# EAGLE design LEscalierD (EAGLE 7.2.0)
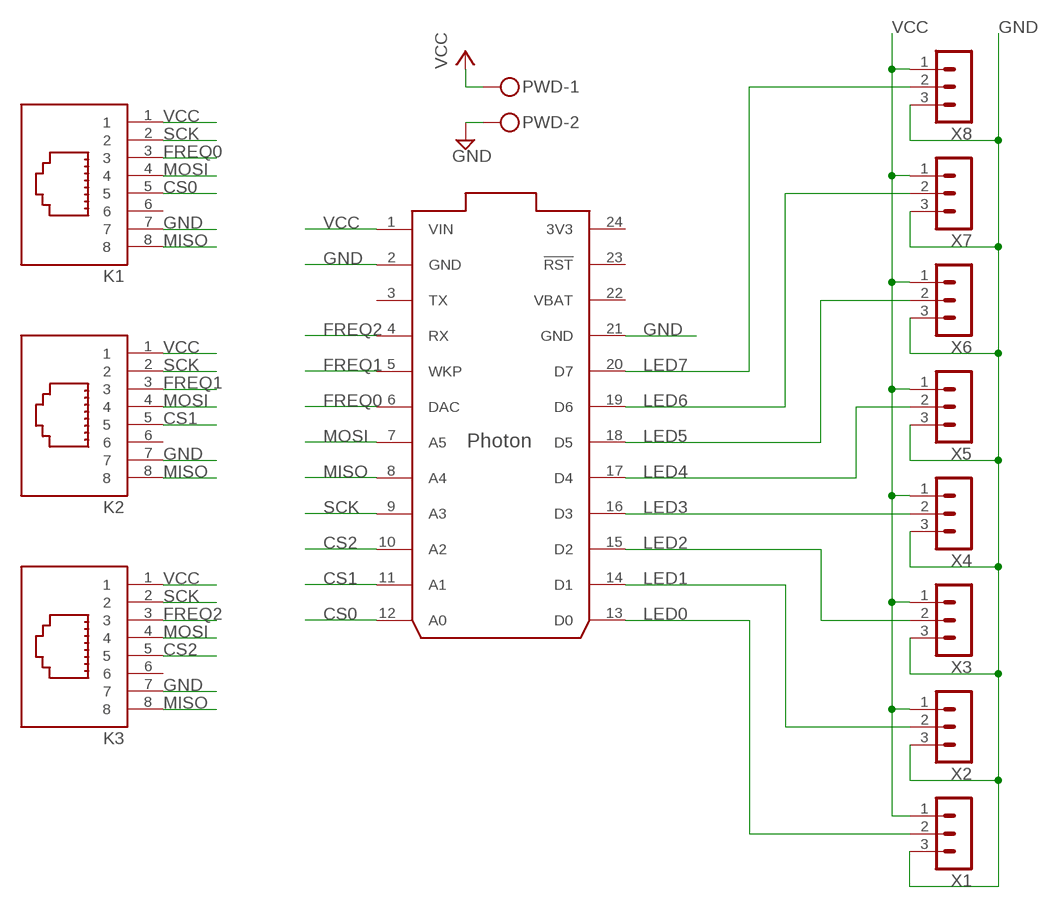
[diagram p0: schematic, sheet 1]

## Parts
K1  615008144221  [615008144221]
K2  615008144221  [615008144221]
K3  615008144221  [615008144221]
PWD  MKDSN1,5/2-5,08  [MKDSN1,5/2-5,08]
U1  PHOTON_WITH_HEADERS  [PHOTON]
X1  B3B-XASTD  [B3B-XA]
X2  B3B-XASTD  [B3B-XA]
X3  B3B-XASTD  [B3B-XA]
X4  B3B-XASTD  [B3B-XA]
X5  B3B-XASTD  [B3B-XA]
X6  B3B-XASTD  [B3B-XA]
X7  B3B-XASTD  [B3B-XA]
X8  B3B-XASTD  [B3B-XA]

## Nets
CS0: K1.5 U1.12(A0)
CS1: K2.5 U1.11(A1)
CS2: K3.5 U1.10(A2)
FREQ0: K1.3 U1.6(DAC)
FREQ1: K2.3 U1.5(WKP)
FREQ2: K3.3 U1.4(RX)
GND [power]: K1.7 K2.7 K3.7 PWD.2 U1.2(GND) U1.21(GND) X1.3 X2.3 X3.3 X4.3 X5.3 X6.3 X7.3 X8.3
LED0 [LED_DATA]: U1.13(D0) X1.2
LED1 [LED_DATA]: U1.14(D1) X2.2
LED2 [LED_DATA]: U1.15(D2) X3.2
LED3 [LED_DATA]: U1.16(D3) X4.2
LED4 [LED_DATA]: U1.17(D4) X5.2
LED5 [LED_DATA]: U1.18(D5) X6.2
LED6 [LED_DATA]: U1.19(D6) X7.2
LED7 [LED_DATA]: U1.20(D7) X8.2
MISO [SPI]: K1.8 K2.8 K3.8 U1.8(A4)
MOSI [SPI]: K1.4 K2.4 K3.4 U1.7(A5)
SCK [SPI]: K1.2 K2.2 K3.2 U1.9(A3)
VCC [power]: K1.1 K2.1 K3.1 PWD.1 U1.1(VIN) X1.1 X2.1 X3.1 X4.1 X5.1 X6.1 X7.1 X8.1
Unconnected: K1.6 K2.6 K3.6 U1.3(TX) U1.23(!RST)

## Power pins joined to a net without a drawn wire
3V3: U1.24(3V3)
VBAT: U1.22(VBAT)

## Library data of the parts
K1-K3 = Input-Output_Connectors_rev15d:615008144221: WR-MJ Vertical Plastic 8P8C Modular Jack With Ears, 8 pins=>Code : Con_I-O_MJ-V_Plastic_615008144221 <http://katalog.we-online.de/media/images/eican/Con_I-O_MJ-V_Plastic_615008144221_pf2.jpg> Details see: http://katalog.we-online.de/en/em/615_008_144_221 Created 2014-07-10, Karrer Zheng 2014 (C) Würth Elektronik
PWD = con-phoenix-508:MKDSN1,5/2-5,08: MKDSN 1,5/ 2-5,08 Printklemme Nennstrom: 13,5 A Nennspannung: 250 V Rastermaß: 5,08 mm Polzahl: 2 Anschlussart: Schraubanschluss Montage: Löten Anschlussrichtung Leiter/Platine: 0 ° Artikelnummer: 1729128 Source: http://eshop.phoenixcontact.com .. 1729128.pdf
U1 = Spark:PHOTON
X1-X8 = con-jst:B3B-XA: JST XA 3POS 2.5MM B03B-XASK-1; MK: DIGIKEY; OC_DIGIKEY: 455-1990-ND; REF: B03B-XASK-1; VEN: JST

## Net classes
0 default: width 0.127 mm
1 power: width 0.508 mm
2 SPI: width 0.178 mm
3 LED_DATA: width 0.229 mm

## Board
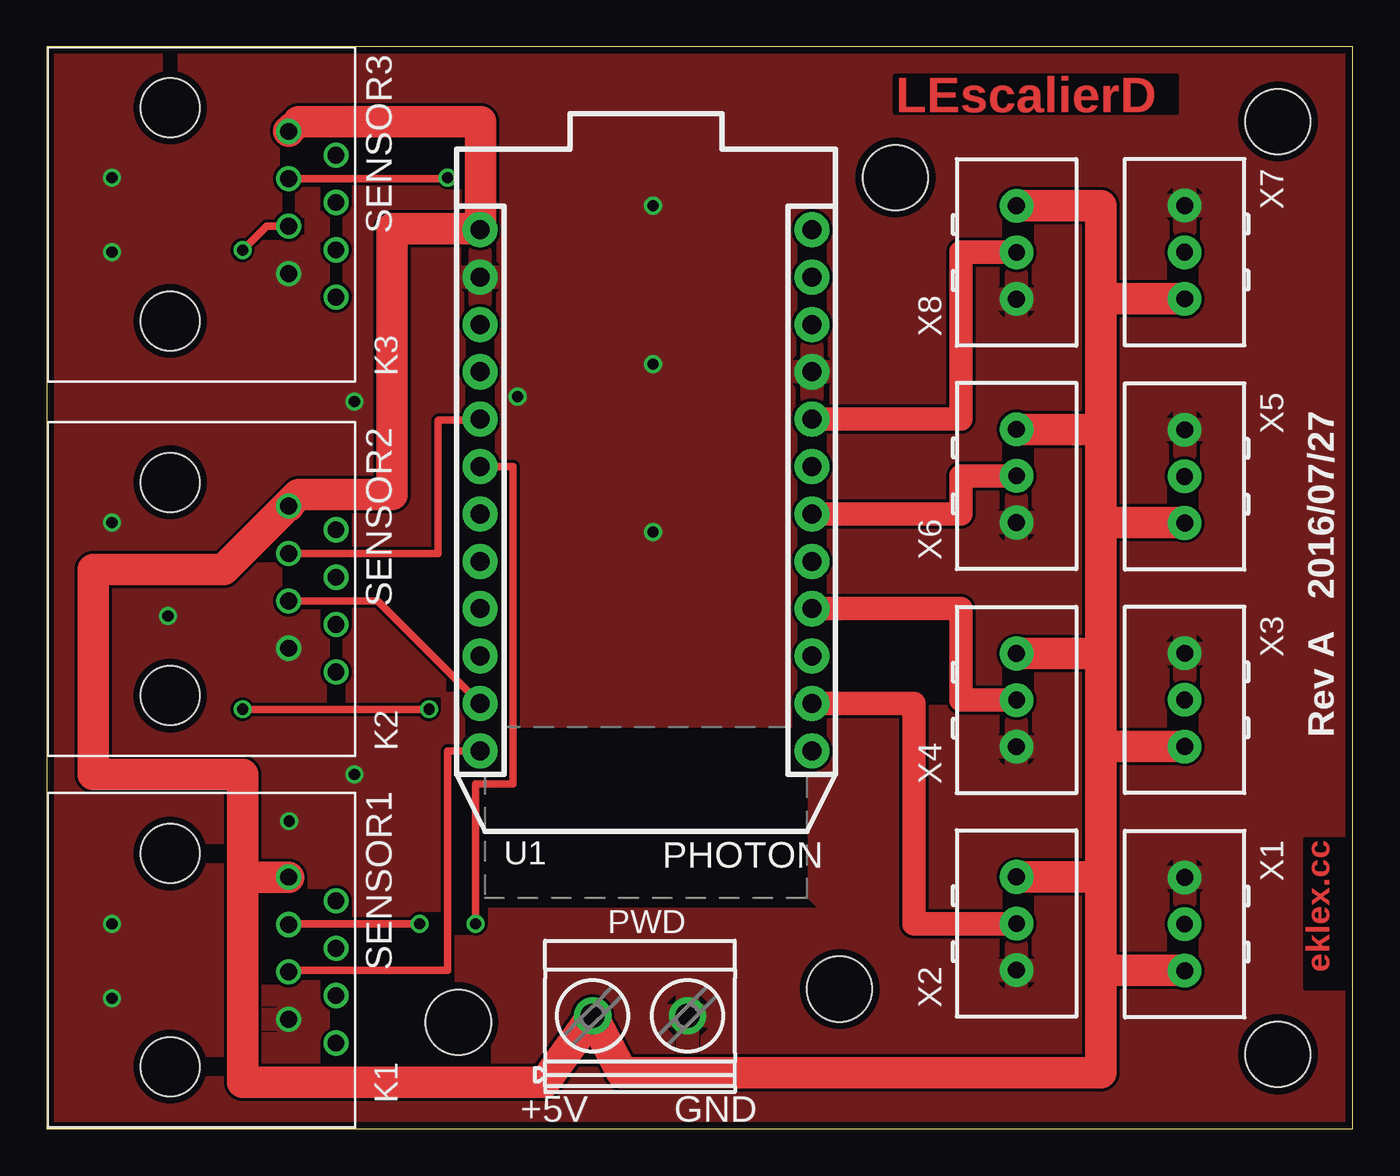
[diagram p1: board, top side]
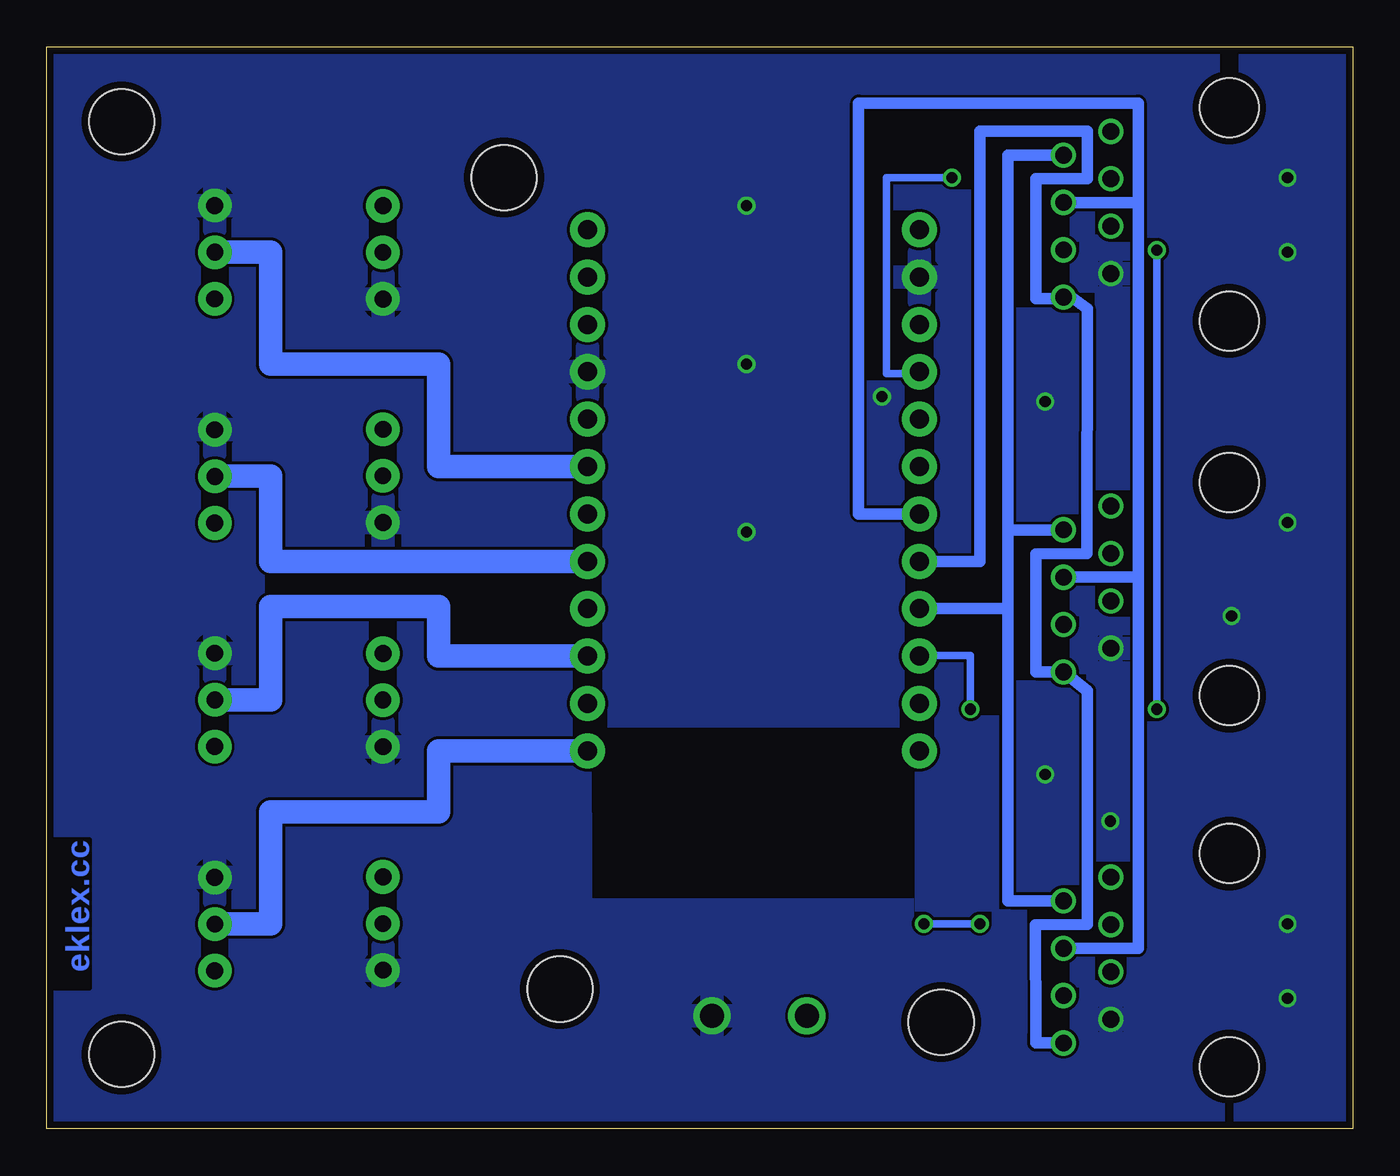
[diagram p2: board, bottom side, seen from below]

Size 70.02 x 58.02 mm. Coordinates in mm from the lower left corner, seen from the top.
Outline: 0,0 70.02,0 70.02,58.02 0,58.02 0,0
Copper layers (1*16): Top 0.0356mm / dielectric 1.5011mm / Bottom 0.0356mm
Design rules "oshpark-2layer": minimum track width 6mil, minimum drill 13mil, track to track 6mil, track to pad 6mil, pad to pad 6mil, via to via 6mil, smd to smd 6mil, copper to edge 15mil, drill to drill 6mil, minimum pad ring 7mil, minimum via ring 7mil, stop-mask expansion 2.5mil, vias tented up to drill 0mil, thermal gap 10mil
Holes 3.5 mm at 45.5,51 42.5,7.5 22.07,5.72 66,54 66,4

### Footprints (pad centres in the part's own frame; a part is rotated, then mirrored left to right if it is on the bottom)
615008144221 = drill 0.9: 1 -4.445,-1.27; 2 -3.175,1.27; 3 -1.905,-1.27; 4 -0.635,1.27; 5 0.635,-1.27; 6 1.905,1.27; 7 3.175,-1.27; 8 4.445,1.27 | hole 3.17: -5.715,-7.62; 5.715,-7.62
MKDSN1,5/2-5,08 = drill 1.3 pad 2: 1 -2.561,0.025; 2 2.519,0.025
PHOTON = drill 1.016 pad 1.88: 1 1.27,32.258; 2 1.27,29.718; 3 1.27,27.178; 4 1.27,24.638; 5 1.27,22.098; 6 1.27,19.558; 7 1.27,17.018; 8 1.27,14.478; 9 1.27,11.938; 10 1.27,9.398; 11 1.27,6.858; 12 1.27,4.318; 13 19.05,4.318; 14 19.05,6.858; 15 19.05,9.398; 16 19.05,11.938; 17 19.05,14.478; 18 19.05,17.018; 19 19.05,19.558; 20 19.05,22.098; 21 19.05,24.638; 22 19.05,27.178; 23 19.05,29.718; 24 19.05,32.258
B3B-XA = drill 0.9 pad 1.8: 1 2.5,0; 2 0,-0.01; 3 -2.5,0

### Placement (x,y rotation side)
K1  14.24,9.05 270 top
K2  14.24,28.94 270 top
K3  14.24,49.03 270 top
PWD  31.83,6.04 0 top
U1  21.97,15.95 0 top
X1  61.01,10.98 270 top
X2  51.99,11.01 90 top
X3  61.01,23 270 top
X4  51.99,22.99 90 top
X5  61.01,34.98 270 top
X6  51.99,35.01 90 top
X7  61.01,47 270 top
X8  51.99,46.99 90 top

### Tracks (layer width: path | path; a pad name or v marks a point on that pad's centre or on a via)
CS0
  Top 0.406: U1.12 21.5,20.27 21.5,8.5 13.05,8.5 K1.5
CS1
  Top 0.406: U1.11 17.74,28.3 K2.5
CS2  (via drill 0.6)
  Top 0.406: v10.5,22.5 v20.5,22.5 | v10.5,47.11 11.79,48.4 K3.5
  Bottom 0.406: U1.10 22.89,25.37 20.5,25.37 v20.5,22.5 | v10.5,47.11 v10.5,22.5
FREQ0  (via drill 0.6)
  Top 0.406: K1.3 13.02,11 v20,11 | v23,11 23,18.5 25,18.5 25,35.5 24.99,35.51 U1.6
  Bottom 0.406: v20,11 v23,11
FREQ1
  Top 0.406: U1.5 23.19,38 21,38 20.98,37.98 20.98,30.84 | 20.98,30.84 | 20.98,30.84 K2.3
FREQ2  (via drill 0.6)
  Top 0.406: v21.5,51 21.43,50.94 K3.3
  Bottom 0.406: U1.4 23.33,40.5 25,40.5 25,51 v21.5,51
GND  (via drill 0.6)
  other vias: 16.5,19 16.5,39 25.24,39.26 13,16.5 3.5,7 3.5,11 3.5,32.5 6.5,27.5 3.5,47 3.5,51 32.5,49.5 32.5,41 32.5,32
  pour Bottom: -5,63 94,63 95,63 95,-4 -5,-4
  pour Top: -6,64 95,64 95,-9 -6,-9 -9,-9 -9,64
LED0
  Bottom 1.27: X1.2 61,11 58,11 58,17 49,17 49,20.27 U1.13
LED1
  Top 1.27: X2.2 46.5,11 46.5,22.81 U1.14
LED2
  Bottom 1.27: X3.2 58,23 58,28 49,28 49,25.35 U1.15
LED3
  Top 1.27: X4.2 49,23 49,27.89 U1.16
LED4
  Bottom 1.27: X5.2 61,35 58,35 58,30.43 U1.17
LED5
  Top 1.27: X6.2 49,35 49,32.97 U1.18
LED6
  Bottom 1.27: X7.2 58,47 58,41 49,41 49,35.51 U1.19
LED7
  Top 1.27: X8.2 49.01,46.99 49,47 49,38.05 U1.20
MISO
  Bottom 0.406: K2.8
  Bottom 0.61: K2.8 17,24.5 16.99,30.83 14.25,30.84 14.24,43.98 15.09,44.59 K3.8 15.51,44.5 17,44.5 17,50.94 14.22,50.94 14.22,53.49 14.32,53.49 14.32,53.5 20,53.5 20,30.43 U1.8 | K2.8 15.49,24.5 14.23,23.48 14.23,10.96 17.01,10.95 17,5 17,4.61 K1.8
MOSI
  Bottom 0.61: K3.4 11.5,49.66 | 11.5,49.66 11.5,29.57 | 11.5,29.57 11.5,9.67 15.51,9.67 K1.4 | K2.4 11.5,29.57 | U1.7 26.5,32.97 26.5,55 11.5,55 11.5,49.66
N$1
  cutout Top: 40.77,12.4 40.78,12.4 40.78,21.5 23.5,21.5 24,11.89 41.27,11.89
N$2
  cutout Bottom: 23.5,21.5 40.78,21.5 40.77,12.39 23.5,12.39
SCK
  Bottom 0.61: 18.5,32.12 18.5,52.19 15.49,52.2 K3.2 | K1.2 18.23,12.22 18.5,12.23 18.5,27.89 | 18.5,32.12 18.5,28 18.5,27.89 | 18.5,32.12 K2.2 | U1.9 18.5,27.89
VCC
  Top 1.7: 10.5,13.46 10.5,2.5 26.7,2.5 PWD.1 30.83,3 56.5,3 56.5,8.5 | 10.5,13.46 10.5,13.5 | 10.5,13.5 10.51,13.49 K1.1 10.5,13.46 | K3.1 13.5,54 23.26,54 23.27,53.99 23.27,48.24 U1.1 23.2,48.25 18.51,48.25 18.52,47.67 18.52,34.92 18.51,34 13.5,34 12.97,33.47 K2.1 12.88,33.38 9.5,30 2.5,30 2.5,19 10.5,19 10.5,13.5 | 56.5,8.5 56.5,13.5 | 56.5,13.5 56.5,20.5 | 56.5,20.5 56.5,25.5 | 56.5,25.5 56.5,32.5 | 56.5,32.5 56.5,37.5 | 56.5,37.5 56.5,44.5 | 56.5,44.5 56.5,49.5 56.49,49.49 X8.1 | X1.1 60.99,8.5 56.5,8.5 | X2.1 56.5,13.5 | X3.1 56.5,20.5 | X4.1 56.5,25.5 | X5.1 60.99,32.5 56.5,32.5 | X6.1 56.5,37.5 | X7.1 56.5,44.5

### Text on the board
Top: LEscalierD | eklex.cc
Bottom: eklex.cc
tPlace: Rev A 2016/07/27
tNames: SENSOR3 | SENSOR2 | PHOTON | SENSOR1 | +5V | GND